# EAGLE schematic oresat-c3-v1 (EAGLE 9.5.1)

## Sheet 1 of 5: Connectors
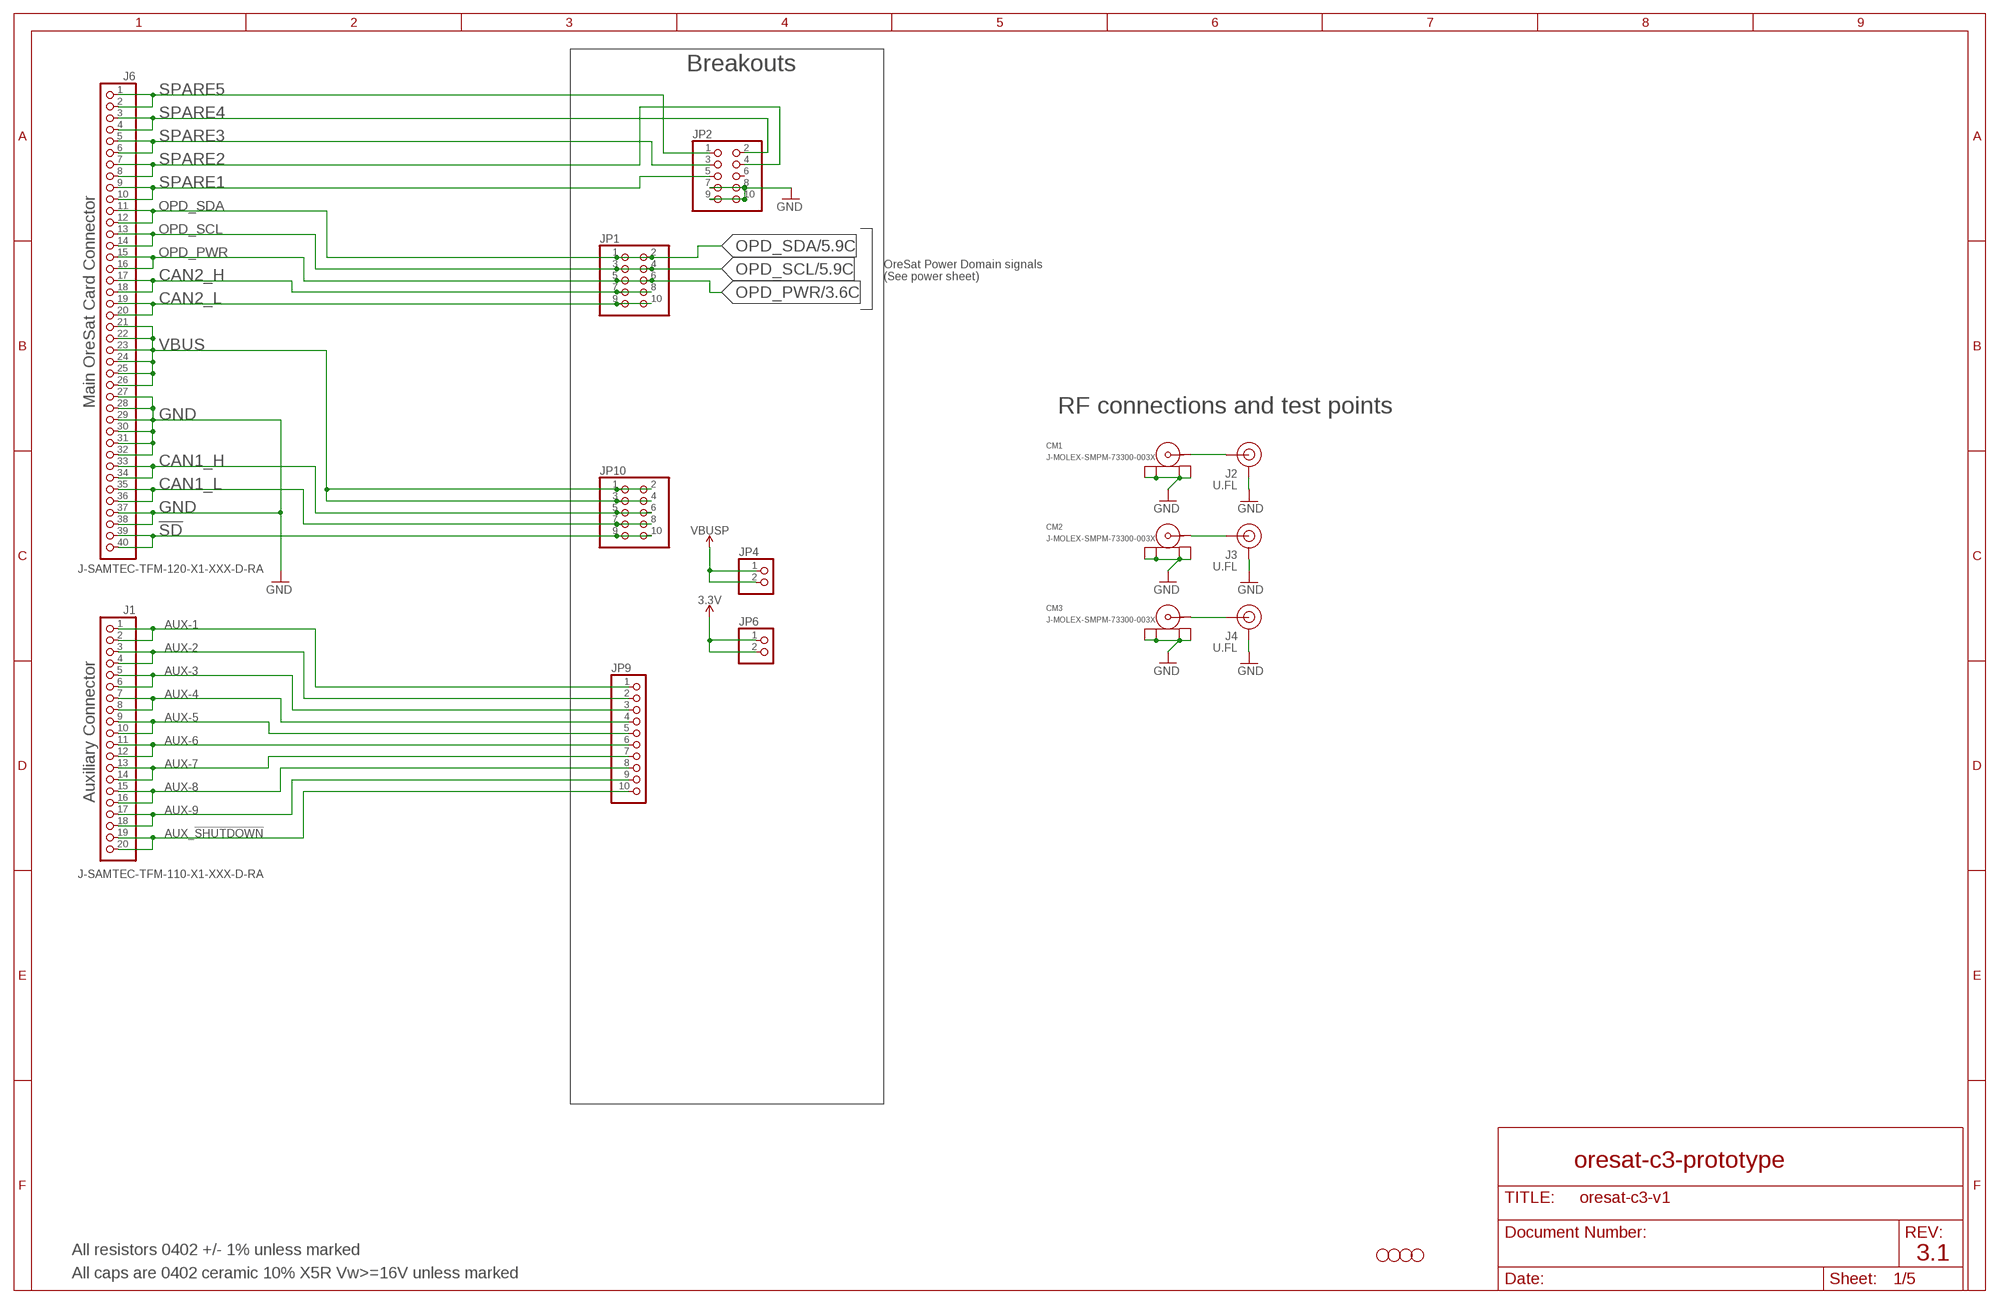
[diagram p0: schematic, sheet 1]

### Parts
CM1  J-MOLEX-SMPM-73300-003X  [J-MOLEX-SMPM-073300-003X]
CM2  J-MOLEX-SMPM-73300-003X  [J-MOLEX-SMPM-073300-003X]
CM3  J-MOLEX-SMPM-73300-003X  [J-MOLEX-SMPM-073300-003X]
H1  STAND-OFFTIGHT  [STAND-OFF-TIGHT]
H2  STAND-OFFTIGHT  [STAND-OFF-TIGHT]
H3  STAND-OFFTIGHT  [STAND-OFF-TIGHT]
H4  STAND-OFFTIGHT  [STAND-OFF-TIGHT]
J1  J-SAMTEC-TFM-110-X1-XXX-D-RA  [J-SAMTEC-TFM-110-X1-XXX-D-RA]
J2  U.FL  U.FL2PIN  [U.FL]
J3  U.FL  U.FL2PIN  [U.FL]
J4  U.FL  U.FL2PIN  [U.FL]
J6  J-SAMTEC-TFM-120-X1-XXX-D-RA  [J-SAMTEC-TFM-120-X1-XXX-D-RA]
JP1  PINHD-2X5  [2X05]
JP2  PINHD-2X5  [2X05]
JP4  PINHD-1X2  [1X02]
JP6  PINHD-1X2  [1X02]
JP9  PINHD-1X10  [1X10]
JP10  PINHD-2X5  [2X05]

### Nets
3.3V: JP6.1 JP6.2 ; also sheet 2,3,4,5
!SD: J6.39 J6.40 JP10.9 JP10.10 ; also sheet 5
AUX-1: J1.1 J1.2 JP9.1
AUX-2: J1.3 J1.4 JP9.2
AUX-3: J1.5 J1.6 JP9.3
AUX-4: J1.7 J1.8 JP9.4
AUX-5: J1.9 J1.10 JP9.5
AUX-6: J1.11 J1.12 JP9.6
AUX-7: J1.13 J1.14 JP9.7
AUX-8: J1.15 J1.16 JP9.8
AUX-9: J1.17 J1.18 JP9.9
AUX_!SHUTDOWN: J1.19 J1.20 JP9.10
CAN1_H: J6.33 J6.34 JP10.5 JP10.6 ; also sheet 5
CAN1_L: J6.35 J6.36 JP10.7 JP10.8 ; also sheet 5
CAN2_H: J6.17 J6.18 JP1.7 JP1.8 ; also sheet 5
CAN2_L: J6.19 J6.20 JP1.9 JP1.10 ; also sheet 5
GND: CM1.P$1(SHIELD3) CM1.P$2(SHIELD2) CM1.P$3(SHIELD1) CM1.P$4(SHIELD) CM2.P$1(SHIELD3) CM2.P$2(SHIELD2) CM2.P$3(SHIELD1) CM2.P$4(SHIELD) CM3.P$1(SHIELD3) CM3.P$2(SHIELD2) CM3.P$3(SHIELD1) CM3.P$4(SHIELD) J2.1(GND) J2.2(GND) J3.1(GND) J3.2(GND) J4.1(GND) J4.2(GND) J6.27 J6.28 J6.29 J6.30 J6.31 J6.32 J6.37 J6.38 JP2.7 JP2.8 JP2.9 JP2.10 ; also sheet 2,3,4,5
N$300: CM3.RF(CENTER) J4.FEED(SIGNAL)
OPD_PWR: J6.15 J6.16 JP1.5 JP1.6 ; also sheet 3,5
OPD_SCL: J6.13 J6.14 JP1.3 JP1.4 ; also sheet 5
OPD_SDA: J6.11 J6.12 JP1.1 JP1.2 ; also sheet 5
RF1: CM1.RF(CENTER) J2.FEED(SIGNAL)
RF2: CM2.RF(CENTER) J3.FEED(SIGNAL)
SPARE1: J6.9 J6.10 JP2.5
SPARE2: J6.7 J6.8 JP2.4
SPARE3: J6.5 J6.6 JP2.3
SPARE4: J6.3 J6.4 JP2.2
SPARE5: J6.1 J6.2 JP2.1
VBUS: J6.21 J6.22 J6.23 J6.24 J6.25 J6.26 JP10.1 JP10.2 JP10.3 JP10.4 ; also sheet 2
VBUSP: JP4.1 JP4.2 ; also sheet 2,5
Unconnected: JP2.6

### Notes on the sheet
- Breakouts
- OreSat Power Domain signals
  (See power sheet)
- Main OreSat Card Connector
- RF connections and test points
- Auxiliary Connector
- oresat-c3-prototype
- All resistors 0402 +/- 1% unless marked
- 3.1
- All caps are 0402 ceramic 10% X5R Vw>=16V unless marked

## Sheet 2 of 5: Power
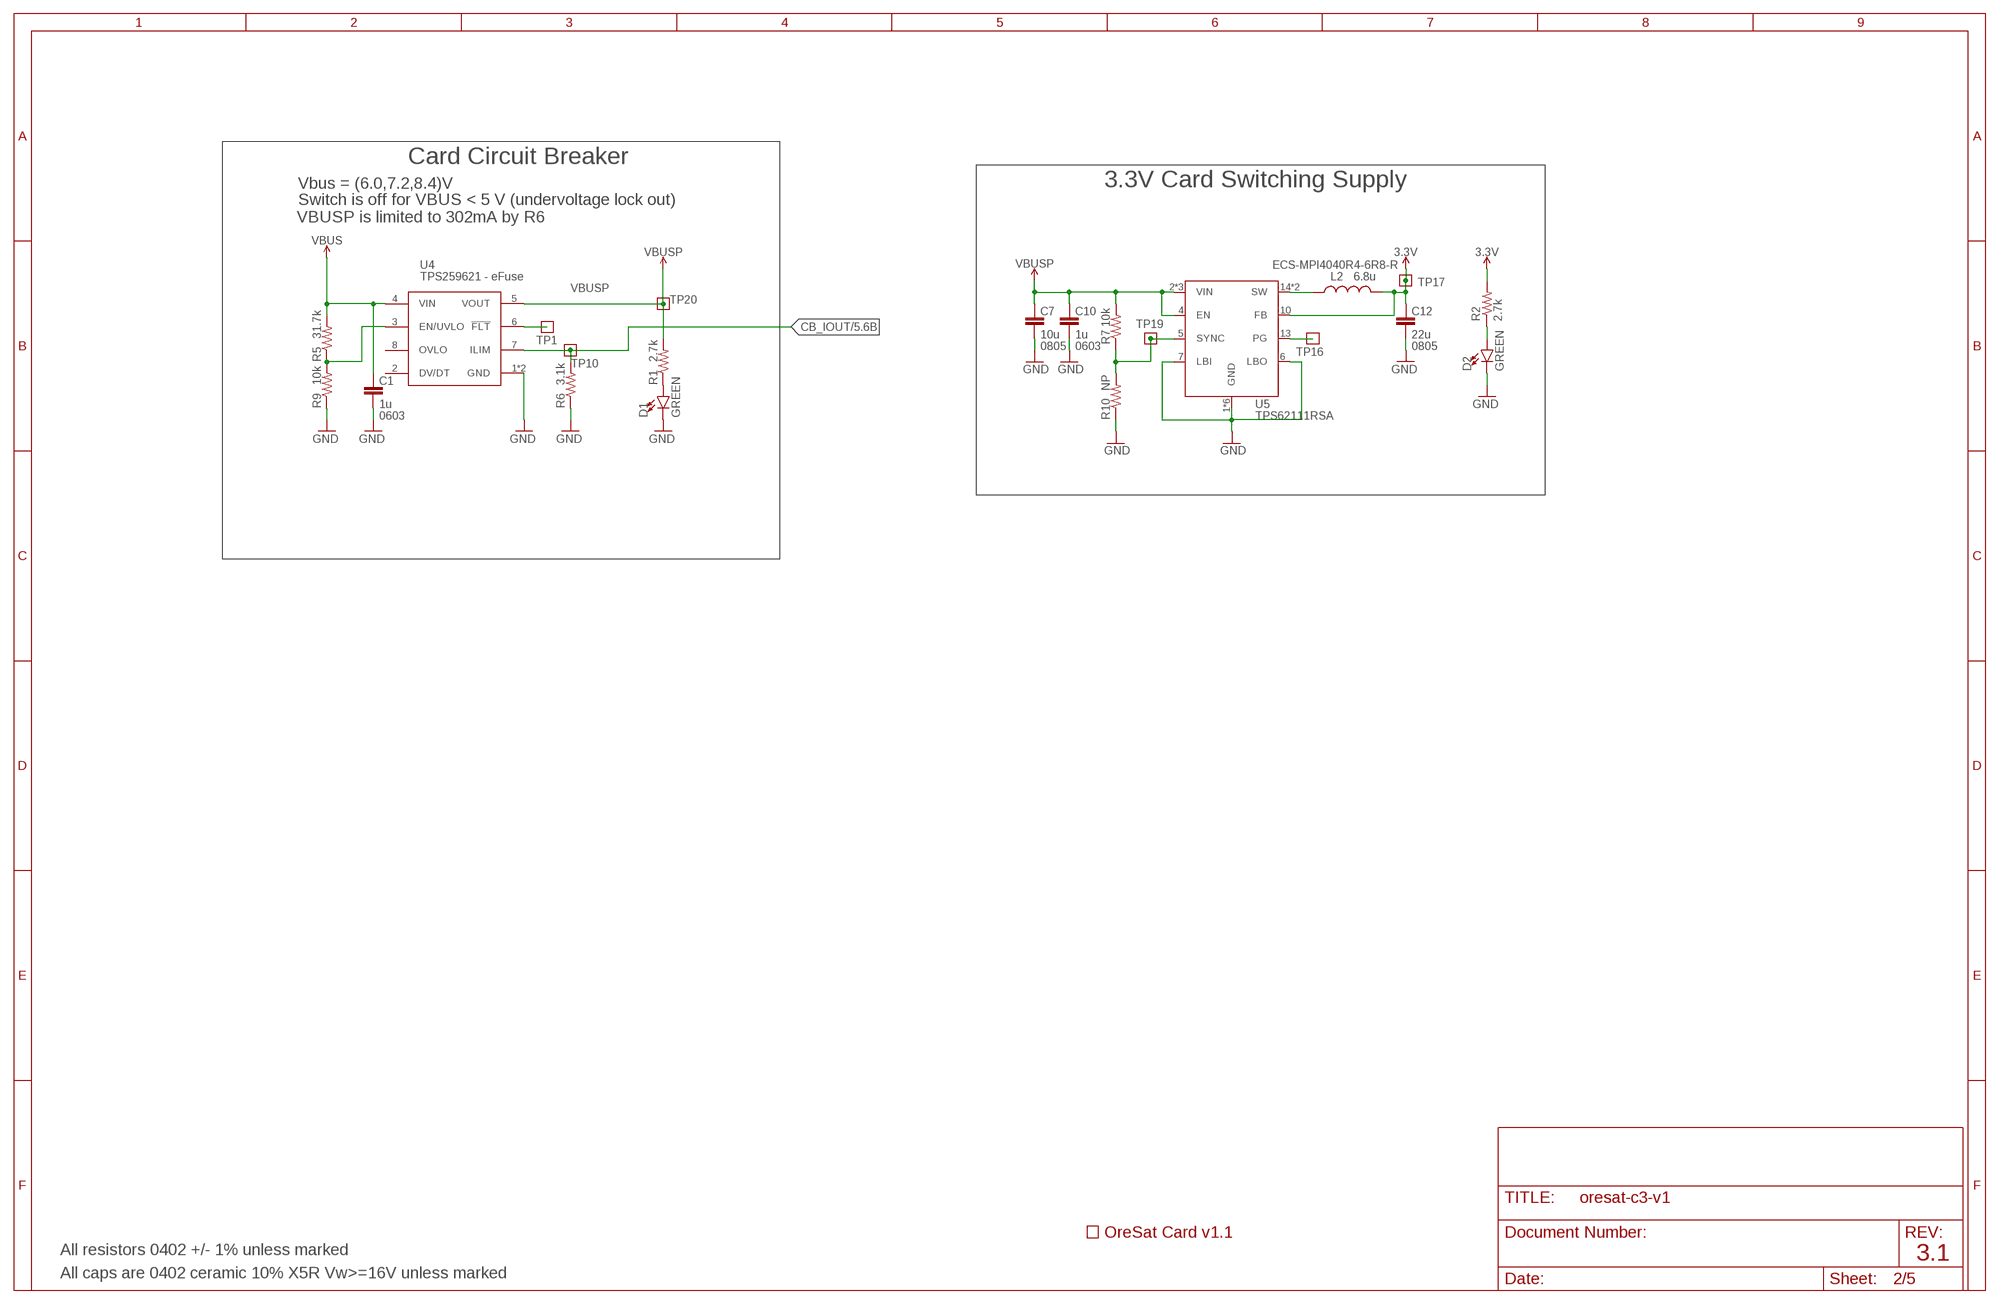
[diagram p1: schematic, sheet 2]

### Parts
C1  1u  C-EU0603-B-NOSILK  [.0603-B-NOSILK]
C7  10u  C-EU0805-B-NOSILK  [.0805-B-NOSILK]
C10  1u  C-EU0603-B-NOSILK  [.0603-B-NOSILK]
C12  22u  C-EU0805-B-NOSILK  [.0805-B-NOSILK]
D1  GREEN  LED-GREEN0603  [LED-0603]
D2  GREEN  LED-GREEN0603  [LED-0603]
L2  6.8u  L-ECS-MPI4040  [ECS-MPI4040]
R1  2.7k  R-US_0402-B-NOSILK  [.0402-B-NOSILK]
R2  2.7k  R-US_0402-B-NOSILK  [.0402-B-NOSILK]
R5  31.7k  R-US_0402-B-NOSILK  [.0402-B-NOSILK]
R6  3.1k  R-US_0402-B-NOSILK  [.0402-B-NOSILK]
R7  10k  R-US_0402-B-NOSILK  [.0402-B-NOSILK]
R9  10k  R-US_0402-B-NOSILK  [.0402-B-NOSILK]
R10  NP  R-US_0402-B-NOSILK  [.0402-B-NOSILK]
TP1  TEST-POINT  [2MM-TEST-POINT]
TP10  TEST-POINT  [2MM-TEST-POINT]
TP16  TEST-POINT  [2MM-TEST-POINT]
TP17  TEST-POINT  [2MM-TEST-POINT]
TP19  TEST-POINT  [2MM-TEST-POINT]
TP20  TEST-POINT  [2MM-TEST-POINT]
U4  TPS259621 - eFuse  TPS2596XX  [SO-POWERPAD-8]
U5  TPS62111RSA  TPS6211X  [S-PVQFN-16]
U$1  ORESAT-CARD-V1.1-3XRF  [ORESAT-CARD-V1.1-3XRF]

### Nets
3.3V: C12.1 L2.2 R2.2 TP17.1 U5.10(FB) ; also sheet 1,3,4,5
!CB_FLT: TP1.1 U4.6(!FLT)
CB_IOUT: R6.2 TP10.1 U4.7(ILIM) ; also sheet 5
EN/UVLO: R5.1 R9.2 U4.3(EN/UVLO)
GND: C1.2 C7.2 C10.2 C12.2 D1.C D2.C R6.1 R9.1 R10.1 U4.1(GND) U4.THERMAL(GND) U5.1(GND) U5.6(LBO) U5.7(LBI) U5.9(GND) U5.11(GND) U5.12(GND) U5.16(GND) U5.PAD(GND) ; also sheet 1,3,4,5
N$270: D1.A R1.1
N$271: D2.A R2.1
TPS62111-PG: TP16.1 U5.13(PG)
TPS62111-SYNC: R7.1 R10.2 TP19.1 U5.5(SYNC)
TPS62111_SW: L2.1 U5.14(SW) U5.15(SW)
VBUS: C1.1 R5.2 U4.4(VIN) ; also sheet 1
VBUSP: C7.1 C10.1 R1.2 R7.2 TP20.1 U4.5(VOUT) U5.2(VIN) U5.3(VIN) U5.4(EN) U5.8(VIN) ; also sheet 1,5
Unconnected: U4.2(DV/DT) U4.8(OVLO)

### Notes on the sheet
- Card Circuit Breaker
- Vbus = (6.0,7.2,8.4)V | 3.3V Card Switching Supply
- Switch is off for VBUS < 5 V (undervoltage lock out)
- VBUSP is limited to 302mA by R6
- ECS-MPI4040R4-6R8-R
- 0805 | 0603 | 0805
- 0603
- All resistors 0402 +/- 1% unless marked
- 3.1
- All caps are 0402 ceramic 10% X5R Vw>=16V unless marked

## Sheet 3 of 5: OPD
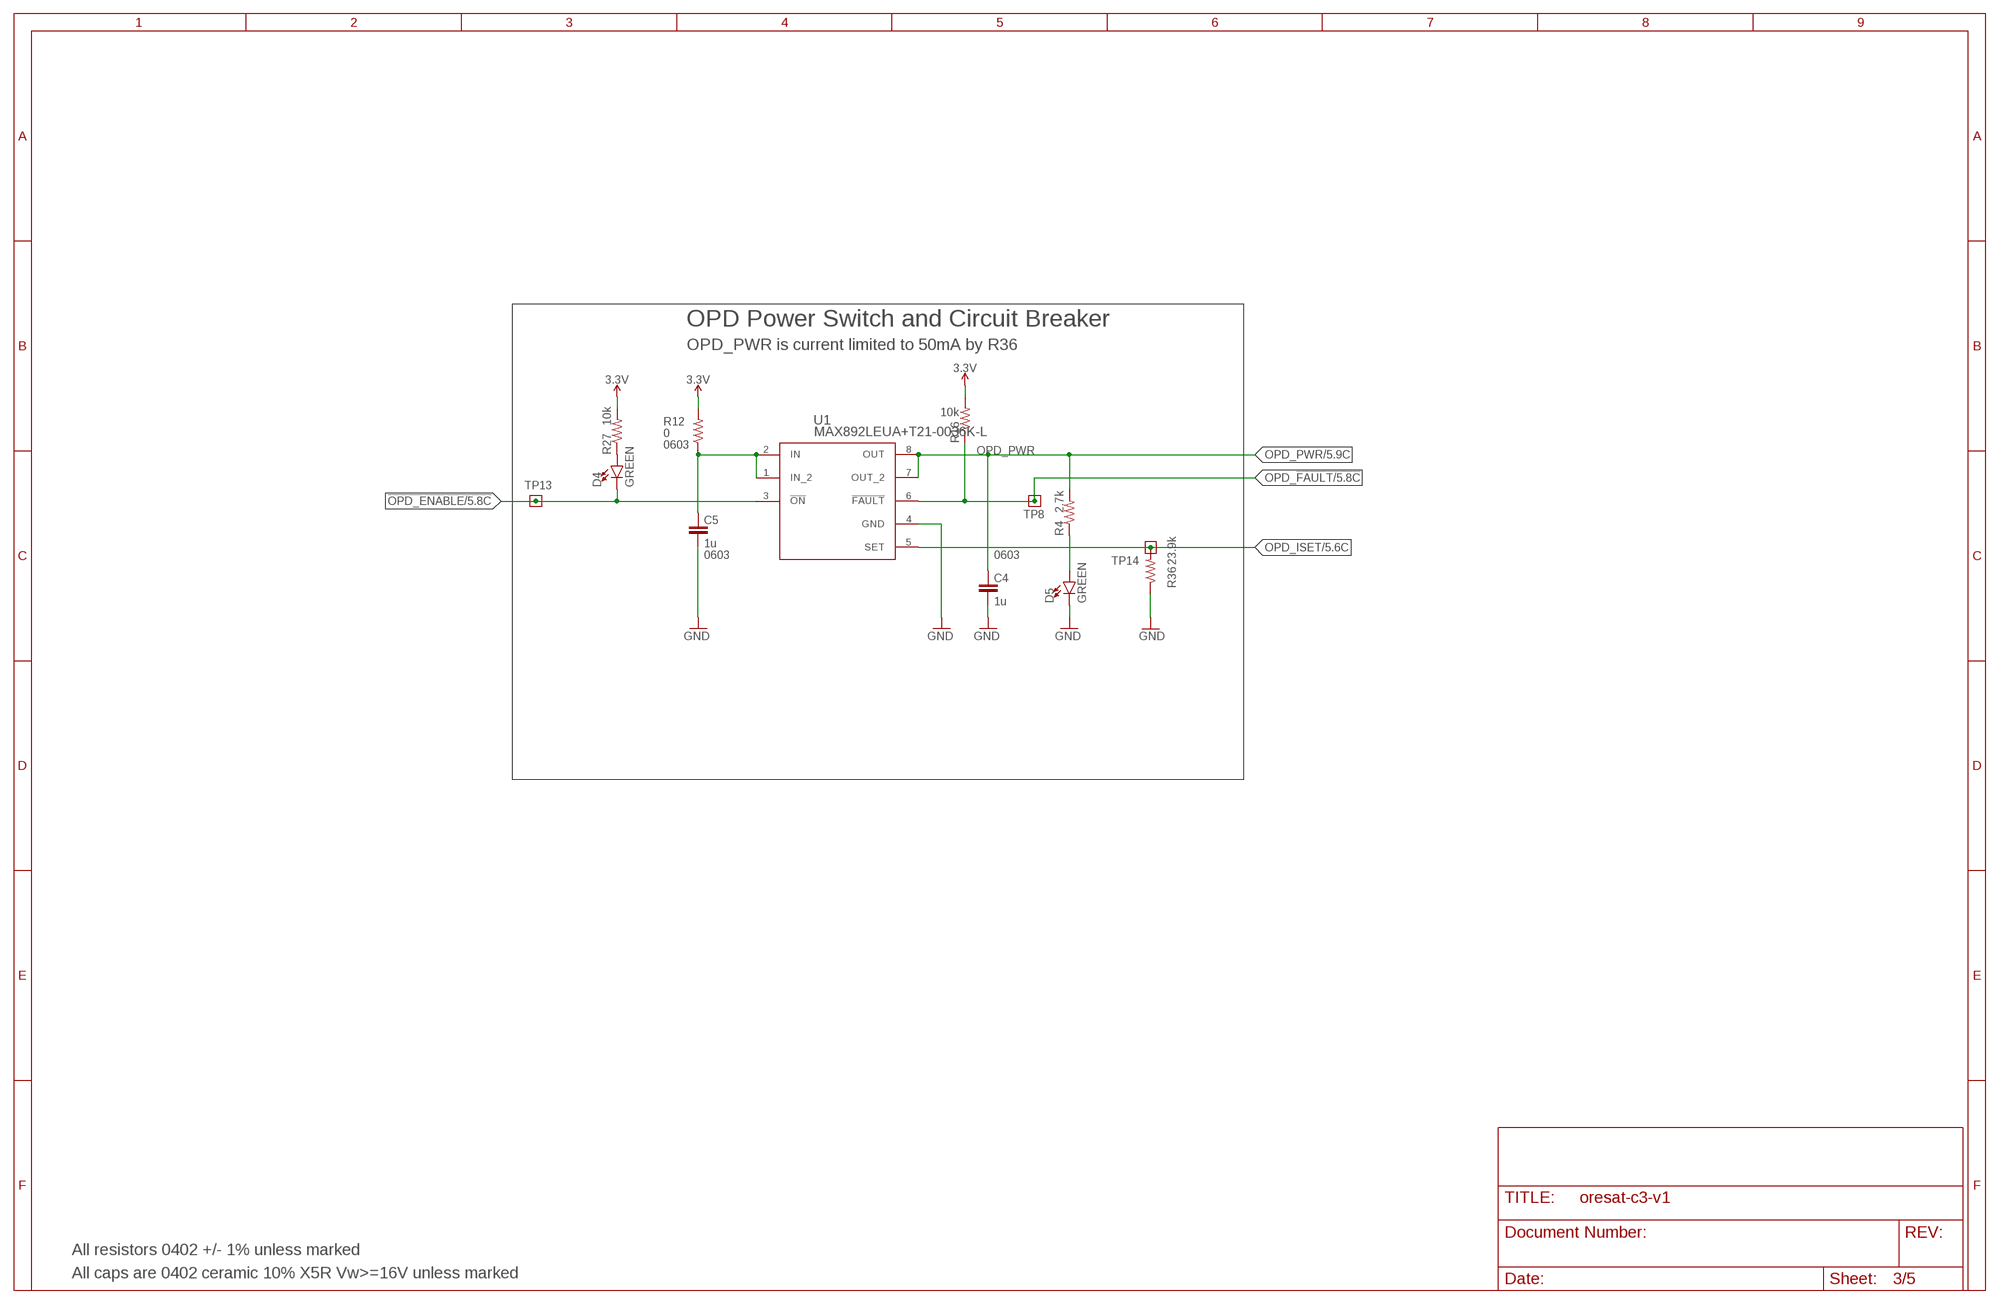
[diagram p2: schematic, sheet 3]

### Parts
C4  1u  C-EU0603-B-NOSILK  [.0603-B-NOSILK]
C5  1u  C-EU0603-B-NOSILK  [.0603-B-NOSILK]
D4  GREEN  LED-GREEN0603  [LED-0603]
D5  GREEN  LED-GREEN0603  [LED-0603]
R4  2.7k  R-US_0402-B-NOSILK  [.0402-B-NOSILK]
R12  0  R-US_0603-B-NOSILK  [.0603-B-NOSILK]
R16  10k  R-US_0402-B-NOSILK  [.0402-B-NOSILK]
R27  10k  R-US_0402-B-NOSILK  [.0402-B-NOSILK]
R36  23.9k  R-US_0402-B-NOSILK  [.0402-B-NOSILK]
TP8  TEST-POINT  [2MM-TEST-POINT]
TP13  TEST-POINT  [2MM-TEST-POINT]
TP14  TEST-POINT  [2MM-TEST-POINT]
U1  MAX892LEUA+T21-0036K-L  [21-0036K-L]

### Nets
3.3V: R12.2 R16.2 R27.2 ; also sheet 1,2,4,5
!OPD_ENABLE: D4.C TP13.1 U1.3(!ON) ; also sheet 5
GND: C4.2 C5.2 D5.C R36.1 U1.4(GND) ; also sheet 1,2,4,5
N$5: D4.A R27.1
N$400: D5.A R4.1
OPD-3.3V: C5.1 R12.1 U1.1(IN_2) U1.2(IN)
OPD_!FAULT: R16.1 TP8.1 U1.6(!FAULT) ; also sheet 5
OPD_ISET: R36.2 TP14.1 U1.5(SET) ; also sheet 5
OPD_PWR: C4.1 R4.2 U1.7(OUT_2) U1.8(OUT) ; also sheet 1,5

### Notes on the sheet
- OPD Power Switch and Circuit Breaker
- OPD_PWR is current limited to 50mA by R36
- 0603
- 0603 | 0603
- All resistors 0402 +/- 1% unless marked
- All caps are 0402 ceramic 10% X5R Vw>=16V unless marked

## Sheet 4 of 5: Radio
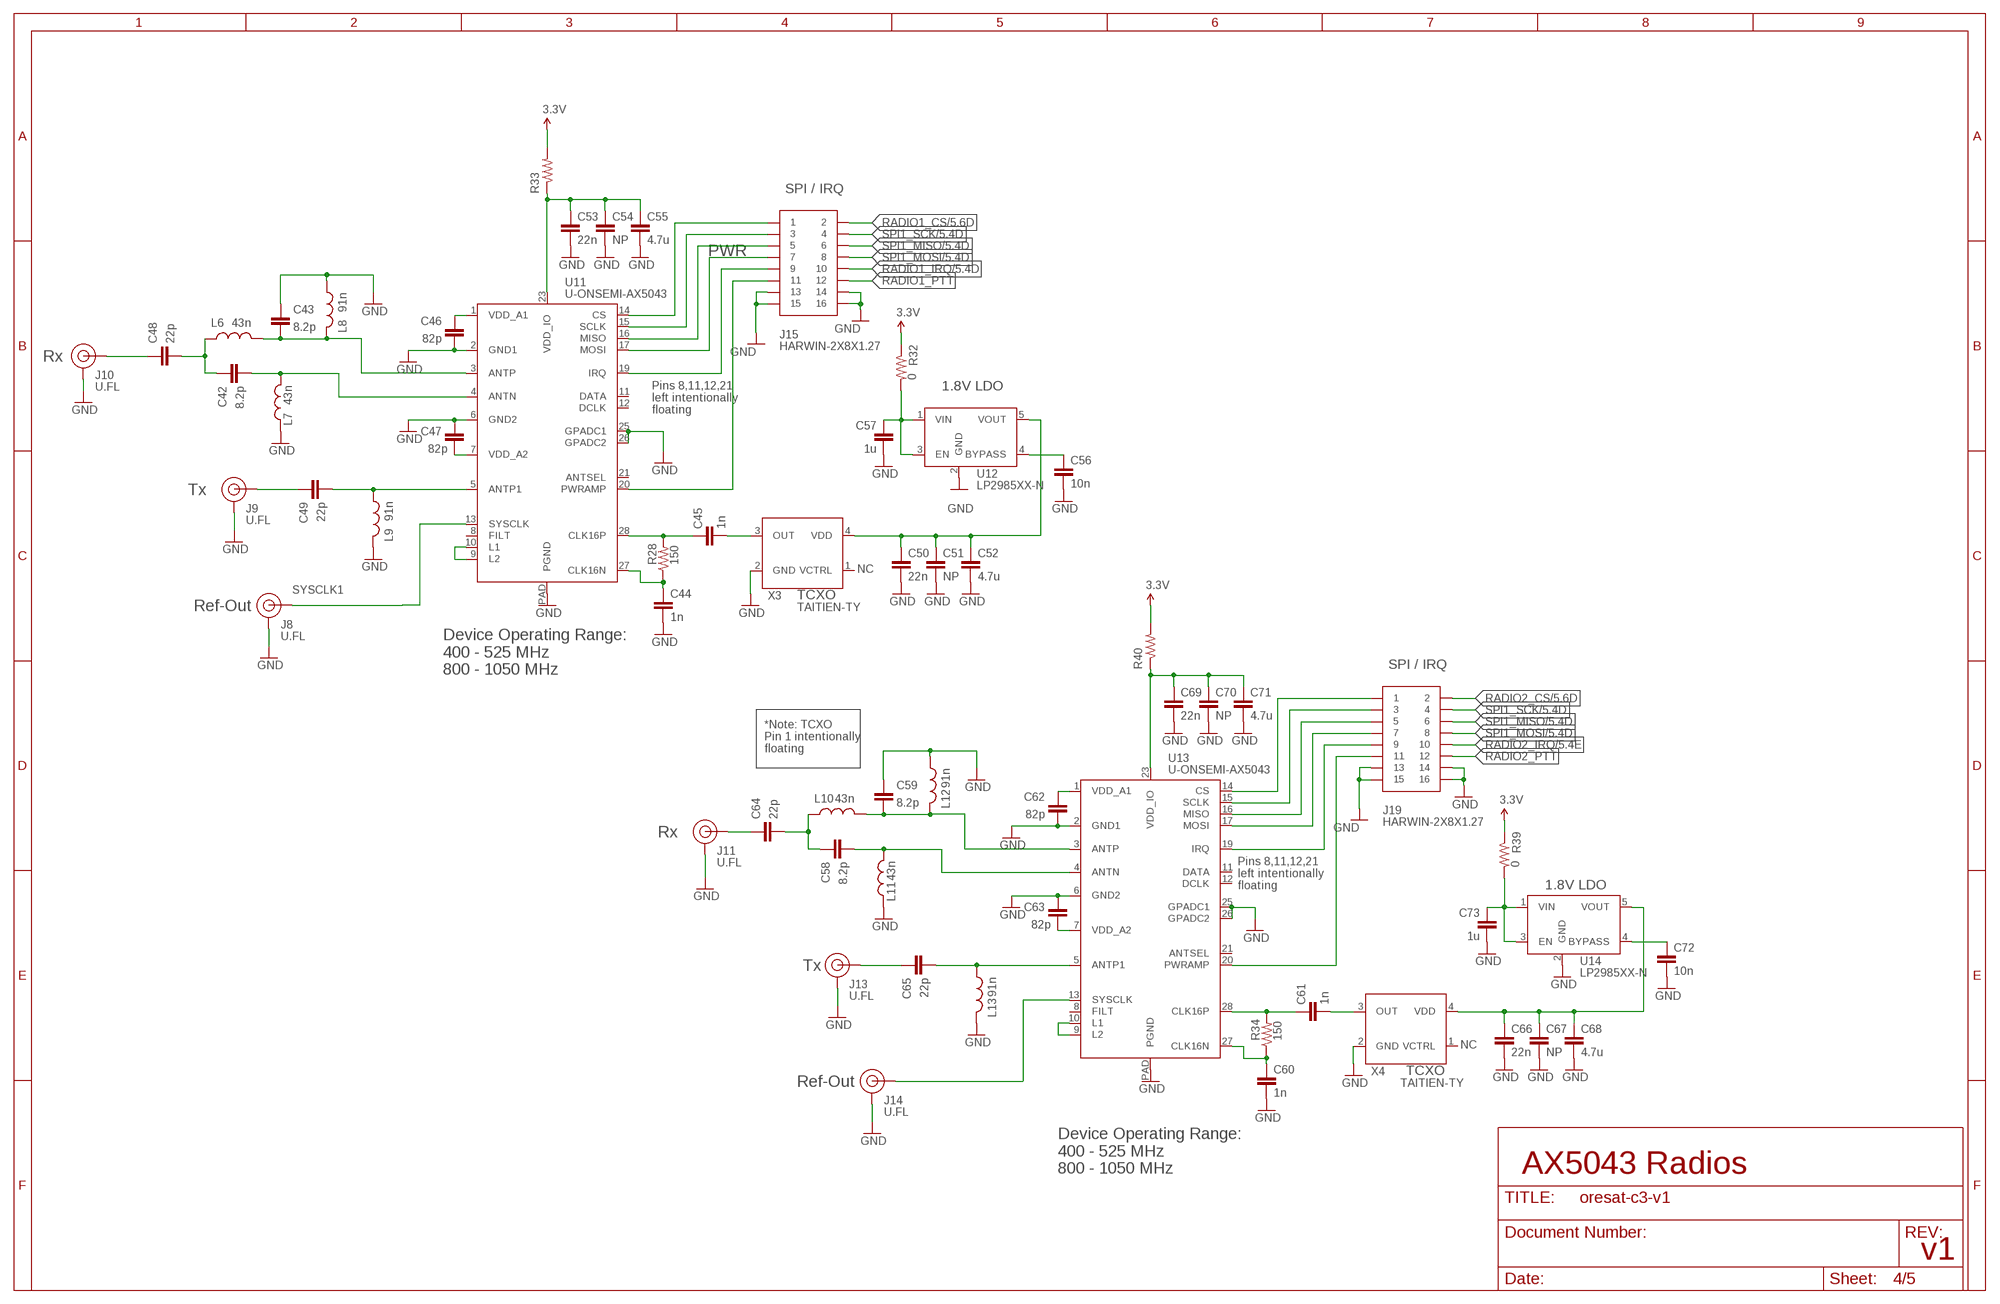
[diagram p3: schematic, sheet 4]

### Parts
C42  8.2p  C-EU0402-C-NOSILK  [.0402-C-NOSILK]
C43  8.2p  C-EU0402-C-NOSILK  [.0402-C-NOSILK]
C44  1n  C-EU0402-C-NOSILK  [.0402-C-NOSILK]
C45  1n  C-EU0402-C-NOSILK  [.0402-C-NOSILK]
C46  82p  C-EU0402-C-NOSILK  [.0402-C-NOSILK]
C47  82p  C-EU0402-C-NOSILK  [.0402-C-NOSILK]
C48  22p  C-EU0402-C-NOSILK  [.0402-C-NOSILK]
C49  22p  C-EU0402-C-NOSILK  [.0402-C-NOSILK]
C50  22n  C-EU0603-C-NOSILK  [.0603-C-NOSILK]
C51  NP  C-EU0603-C-NOSILK  [.0603-C-NOSILK]
C52  4.7u  C-EU0603-C-NOSILK  [.0603-C-NOSILK]
C53  22n  C-EU0603-C-NOSILK  [.0603-C-NOSILK]
C54  NP  C-EU0603-C-NOSILK  [.0603-C-NOSILK]
C55  4.7u  C-EU0603-C-NOSILK  [.0603-C-NOSILK]
C56  10n  C-EU0603-C-NOSILK  [.0603-C-NOSILK]
C57  1u  C-EU0603-C-NOSILK  [.0603-C-NOSILK]
C58  8.2p  C-EU0402-C-NOSILK  [.0402-C-NOSILK]
C59  8.2p  C-EU0402-C-NOSILK  [.0402-C-NOSILK]
C60  1n  C-EU0402-C-NOSILK  [.0402-C-NOSILK]
C61  1n  C-EU0402-C-NOSILK  [.0402-C-NOSILK]
C62  82p  C-EU0402-C-NOSILK  [.0402-C-NOSILK]
C63  82p  C-EU0402-C-NOSILK  [.0402-C-NOSILK]
C64  22p  C-EU0402-C-NOSILK  [.0402-C-NOSILK]
C65  22p  C-EU0402-C-NOSILK  [.0402-C-NOSILK]
C66  22n  C-EU0603-C-NOSILK  [.0603-C-NOSILK]
C67  NP  C-EU0603-C-NOSILK  [.0603-C-NOSILK]
C68  4.7u  C-EU0603-C-NOSILK  [.0603-C-NOSILK]
C69  22n  C-EU0603-C-NOSILK  [.0603-C-NOSILK]
C70  NP  C-EU0603-C-NOSILK  [.0603-C-NOSILK]
C71  4.7u  C-EU0603-C-NOSILK  [.0603-C-NOSILK]
C72  10n  C-EU0603-C-NOSILK  [.0603-C-NOSILK]
C73  1u  C-EU0603-C-NOSILK  [.0603-C-NOSILK]
J8  U.FL  U.FL2PIN  [U.FL]
J9  U.FL  U.FL2PIN  [U.FL]
J10  U.FL  U.FL2PIN  [U.FL]
J11  U.FL  U.FL2PIN  [U.FL]
J13  U.FL  U.FL2PIN  [U.FL]
J14  U.FL  U.FL2PIN  [U.FL]
J15  HARWIN-2X8X1.27  [2X8X1.27]
J19  HARWIN-2X8X1.27  [2X8X1.27]
L6  43n  L-US0402-C-NOSILK  [.0402-C-NOSILK]
L7  43n  L-US0402-C-NOSILK  [.0402-C-NOSILK]
L8  91n  L-US0603-C-NOSILK  [.0603-C-NOSILK]
L9  91n  L-US0603-C-NOSILK  [.0603-C-NOSILK]
L10  43n  L-US0402-C-NOSILK  [.0402-C-NOSILK]
L11  43n  L-US0402-C-NOSILK  [.0402-C-NOSILK]
L12  91n  L-US0603-C-NOSILK  [.0603-C-NOSILK]
L13  91n  L-US0603-C-NOSILK  [.0603-C-NOSILK]
R28  150  R-US_0402-C-NOSILK  [.0402-C-NOSILK]
R32  0  R-US_0603-C-NOSILK  [.0603-C-NOSILK]
R33  0  R-US_0603-C-NOSILK  [.0603-C-NOSILK]
R34  150  R-US_0402-C-NOSILK  [.0402-C-NOSILK]
R39  0  R-US_0603-C-NOSILK  [.0603-C-NOSILK]
R40  0  R-US_0603-C-NOSILK  [.0603-C-NOSILK]
U11  U-ONSEMI-AX5043  [QFN28-5X5-WITH-CENTER-PAD]
U12  LP2985XX-N  [SOT-23]
U13  U-ONSEMI-AX5043  [QFN28-5X5-WITH-CENTER-PAD]
U14  LP2985XX-N  [SOT-23]
X3  TAITIEN-TY  [2.5X2.0]
X4  TAITIEN-TY  [2.5X2.0]

### Nets
1V1: C50.1 C51.1 C52.1 U12.5(VOUT) X3.4(VDD)
1V2: C66.1 C67.1 C68.1 U14.5(VOUT) X4.4(VDD)
3.3V: R32.1 R33.2 R39.1 R40.2 ; also sheet 1,2,3,5
ANTN1: C42.2 L7.2 U11.4(ANTN)
ANTN2: C58.2 L11.2 U13.4(ANTN)
ANTP2 [RF1]: C43.2 L6.2 L8.1 U11.3(ANTP)
ANTP3 [RF1]: C49.2 L9.2 U11.5(ANTP1)
ANTP4 [RF1]: C59.2 L10.2 L12.1 U13.3(ANTP)
ANTP5 [RF1]: C65.2 L13.2 U13.5(ANTP1)
CLKN1: C44.1 R28.1 U11.27(CLK16N)
CLKN2: C60.1 R34.1 U13.27(CLK16N)
CLKP1: C45.1 R28.2 U11.28(CLK16P)
CLKP2: C61.1 R34.2 U13.28(CLK16P)
CS1: J15.1 U11.14(CS)
CS2: J19.1 U13.14(CS)
GND: C43.1 C44.2 C46.2 C47.1 C50.2 C51.2 C52.2 C53.2 C54.2 C55.2 C56.2 C57.2 C59.1 C60.2 C62.2 C63.1 C66.2 C67.2 C68.2 C69.2 C70.2 C71.2 C72.2 C73.2 J8.1(GND) J8.2(GND) J9.1(GND) J9.2(GND) J10.1(GND) J10.2(GND) J11.1(GND) J11.2(GND) J13.1(GND) J13.2(GND) J14.1(GND) J14.2(GND) J15.13 J15.14 J15.15 J15.16 J19.13 J19.14 J19.15 J19.16 L7.1 L8.2 L9.1 L11.1 L12.2 L13.1 U11.2(GND1) U11.6(GND2) U11.25(GPADC1) U11.26(GPADC2) U11.PAD(PGND) U12.2(GND) U13.2(GND1) U13.6(GND2) U13.25(GPADC1) U13.26(GPADC2) U13.PAD(PGND) U14.2(GND) X3.2(GND) X4.2(GND) ; also sheet 1,2,3,5
IRQ1: J15.9 U11.19(IRQ)
IRQ2: J19.9 U13.19(IRQ)
MISO1: J15.5 U11.16(MISO)
MISO2: J19.5 U13.16(MISO)
MOSI1: J15.7 U11.17(MOSI)
MOSI2: J19.7 U13.17(MOSI)
N$2: C64.1 J11.FEED(SIGNAL)
N$7: U11.9(L2) U11.10(L1)
N$8: C46.1 U11.1(VDD_A1)
N$9: C47.2 U11.7(VDD_A2)
N$10: C56.1 U12.4(BYPASS)
N$11 [RF2]: C42.1 C48.2 L6.1
N$12 [RF2]: C45.2 X3.3(OUT)
N$13: U13.9(L2) U13.10(L1)
N$14: C62.1 U13.1(VDD_A1)
N$15: C63.2 U13.7(VDD_A2)
N$16: C72.1 U14.4(BYPASS)
N$17 [RF2]: C58.1 C64.2 L10.1
N$18 [RF2]: C61.2 X4.3(OUT)
PWRAMP1: J15.11 U11.20(PWRAMP)
PWRAMP2: J19.11 U13.20(PWRAMP)
RADIO1_CS: J15.2 ; also sheet 5
RADIO1_IRQ: J15.10 ; also sheet 5
RADIO1_PTT: J15.12
RADIO2_CS: J19.2 ; also sheet 5
RADIO2_IRQ: J19.10 ; also sheet 5
RADIO2_PTT: J19.12
RX1 [RF1]: C48.1 J10.FEED(SIGNAL)
SCLK1: J15.3 U11.15(SCLK)
SCLK2: J19.3 U13.15(SCLK)
SPI1_MISO: J15.6 J19.6 ; also sheet 5
SPI1_MOSI: J15.8 J19.8 ; also sheet 5
SPI1_SCK: J15.4 J19.4 ; also sheet 5
SYSCLK1 [RF1]: J8.FEED(SIGNAL) U11.13(SYSCLK)
SYSCLK2 [RF1]: J14.FEED(SIGNAL) U13.13(SYSCLK)
TX1 [RF1]: C49.1 J9.FEED(SIGNAL)
TX2 [RF1]: C65.1 J13.FEED(SIGNAL)
VDD_IO-1: C53.1 C54.1 C55.1 R33.1 U11.23(VDD_IO)
VDD_IO-2: C69.1 C70.1 C71.1 R40.1 U13.23(VDD_IO)
VIN-1V8-1: C57.1 R32.2 U12.1(VIN) U12.3(EN)
VIN-1V8-2: C73.1 R39.2 U14.1(VIN) U14.3(EN)
Unconnected: U11.8(FILT) U11.11(DATA) U11.12(DCLK) U11.21(ANTSEL) U13.8(FILT) U13.11(DATA) U13.12(DCLK) U13.21(ANTSEL) X3.1(VCTRL) X4.1(VCTRL)

### Notes on the sheet
- SPI / IRQ
- PWR
- Rx
- 1.8V LDO
- Pins 8,11,12,21
  left intentionally 
  floating
- Tx
- NC
- TCXO
- Ref-Out
- SPI / IRQ
- Device Operating Range:
  400 - 525 MHz
  800 - 1050 MHz
- *Note: TCXO
  Pin 1 intentionally 
  floating
- Rx
- Pins 8,11,12,21
  left intentionally 
  floating
- 1.8V LDO
- Tx
- NC
- TCXO
- Ref-Out
- Device Operating Range:
  400 - 525 MHz
  800 - 1050 MHz
- AX5043 Radios
- v1

## Sheet 5 of 5: Microcontroller
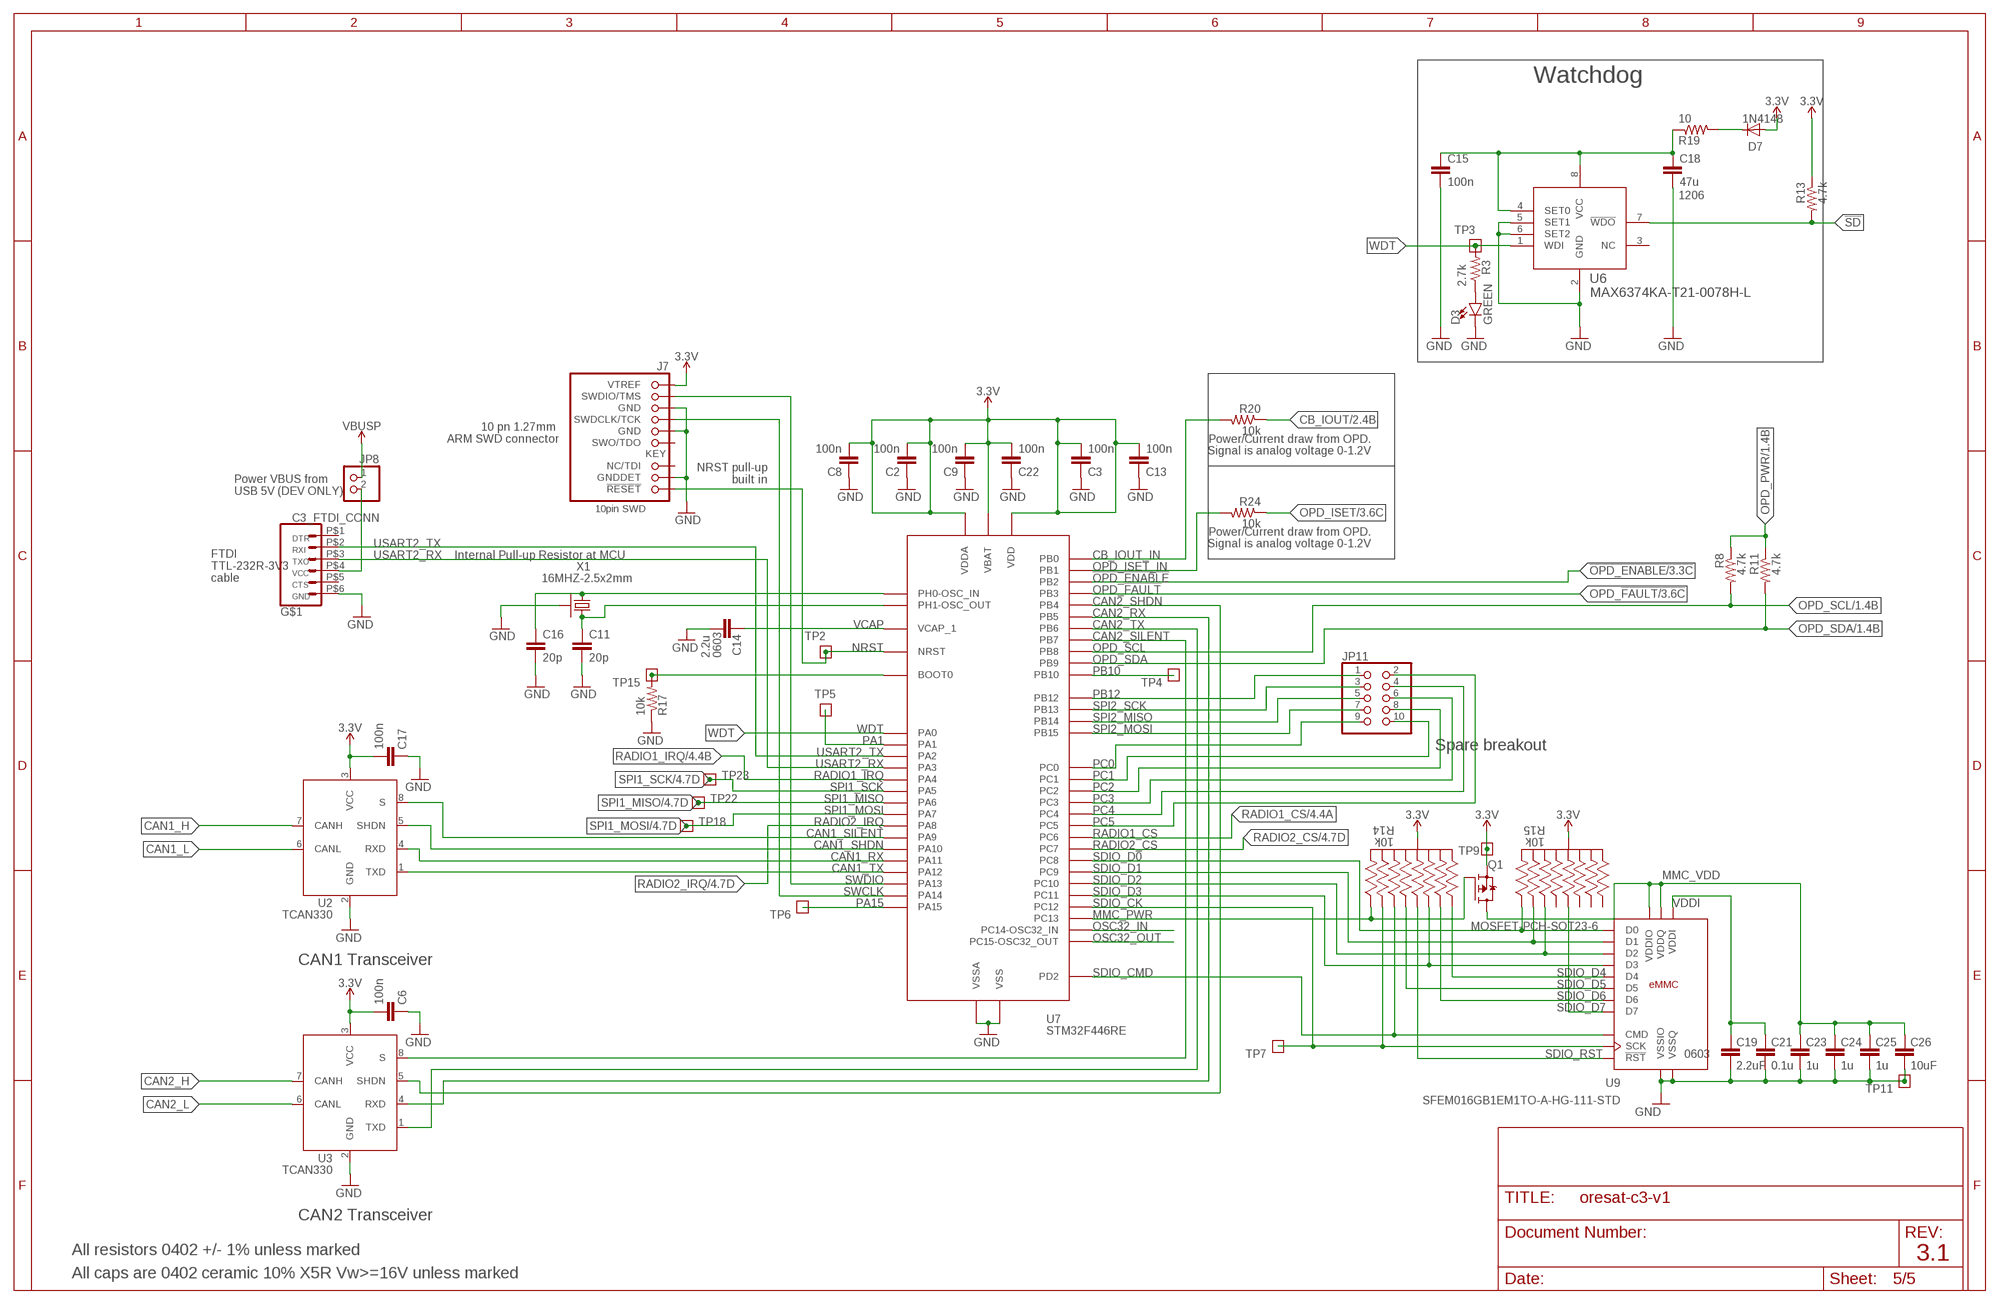
[diagram p4: schematic, sheet 5]

### Parts
C2  100n  C-EU0402-B-NOSILK  [.0402-B-NOSILK]
C3  100n  C-EU0402-B-NOSILK  [.0402-B-NOSILK]
C6  100n  C-EU0402-B-NOSILK  [.0402-B-NOSILK]
C8  100n  C-EU0402-B-NOSILK  [.0402-B-NOSILK]
C9  100n  C-EU0402-B-NOSILK  [.0402-B-NOSILK]
C11  20p  C-EU0402-B-NOSILK  [.0402-B-NOSILK]
C13  100n  C-EU0402-B-NOSILK  [.0402-B-NOSILK]
C14  2.2u  C-EU0603-B-NOSILK  [.0603-B-NOSILK]
C15  100n  C-EU0402-B-NOSILK  [.0402-B-NOSILK]
C16  20p  C-EU0402-B-NOSILK  [.0402-B-NOSILK]
C17  100n  C-EU0402-B-NOSILK  [.0402-B-NOSILK]
C18  47u  C-EU1206-B  [1206-B]
C19  2.2uF  C-EU0603-B-NOSILK  [.0603-B-NOSILK]
C21  0.1u  C-EU0603-B-NOSILK  [.0603-B-NOSILK]
C22  100n  C-EU0402-B-NOSILK  [.0402-B-NOSILK]
C23  1u  C-EU0603-B-NOSILK  [.0603-B-NOSILK]
C24  1u  C-EU0603-B-NOSILK  [.0603-B-NOSILK]
C25  1u  C-EU0603-B-NOSILK  [.0603-B-NOSILK]
C26  10uF  C-EU0603-B-NOSILK  [.0603-B-NOSILK]
D3  GREEN  LED-GREEN0603  [LED-0603]
D7  1N4148  DIODESOD  [SOD-323]
J7  FTSH-105-XX-X-DV-K  [CON10_2X5_DUK_FTSH]
JP8  PINHD-1X2  [1X02]
JP11  PINHD-2X5  [2X05]
Q1  MOSFET-PCH-SOT23-6  [SOT23-6]
R3  2.7k  R-US_0402-B-NOSILK  [.0402-B-NOSILK]
R8  4.7k  R-US_0402-B-NOSILK  [.0402-B-NOSILK]
R11  4.7k  R-US_0402-B-NOSILK  [.0402-B-NOSILK]
R13  4.7k  R-US_0402-B-NOSILK  [.0402-B-NOSILK]
R14  10k  EXB-A10P391JC_ARRAY_EXBA-M  [ARRAY_EXBA-M]
R15  10k  EXB-A10P391JC_ARRAY_EXBA-M  [ARRAY_EXBA-M]
R17  10k  R-US_0402-B-NOSILK  [.0402-B-NOSILK]
R19  10  R-US_0402-B-NOSILK  [.0402-B-NOSILK]
R20  10k  R-US_0402-B-NOSILK  [.0402-B-NOSILK]
R24  10k  R-US_0402-B-NOSILK  [.0402-B-NOSILK]
TP2  TEST-POINT  [2MM-TEST-POINT]
TP3  TEST-POINT  [2MM-TEST-POINT]
TP4  TEST-POINT  [2MM-TEST-POINT]
TP5  TEST-POINT  [2MM-TEST-POINT]
TP6  TEST-POINT  [2MM-TEST-POINT]
TP7  TEST-POINT  [2MM-TEST-POINT]
TP9  TEST-POINT  [2MM-TEST-POINT]
TP11  TEST-POINT  [2MM-TEST-POINT]
TP15  TEST-POINT  [2MM-TEST-POINT]
TP18  TEST-POINT  [2MM-TEST-POINT]
TP22  TEST-POINT  [2MM-TEST-POINT]
TP23  TEST-POINT  [2MM-TEST-POINT]
U2  TCAN330  [SOT23-8_TI-DCN]
U3  TCAN330  [SOT23-8_TI-DCN]
U6  MAX6374KA-T21-0078H-L  [21-0078H-L]
U7  STM32F446RE  [QFP-10X10-64]
U9  SFEM016GB1EM1TO-A-HG-111-STD  EMMC+RESET-BA  [BGA-153(11.5X13)(EMMC-BA)]
U$2  C3_FTDI_CONN  [6_PIN_SERIAL_TARGET_SIDE_W_SILK]
X1  16MHZ-2.5x2mm  CRYSTAL-WITH-GND  [CRYSTAL_2.5X2]

### Nets
3.3V: C2.2 C3.2 C6.2 C8.2 C9.2 C13.2 C17.2 C22.2 D7.2(A) J7.1(VTREF) Q1.4(S) R13.1 R14.5 R14.10 R15.5 R15.10 TP9.1 U2.3(VCC) U3.3(VCC) U7.1(VBAT) U7.13(VDDA) U7.19(VDD) U7.32(VDD) U7.48(VDD) U7.64(VDD) ; also sheet 1,2,3,4
!OPD_ENABLE: U7.28(PB2) ; also sheet 3
!SD: R13.2 U6.7(!WDO) ; also sheet 1
BOOT0: R17.2 TP15.1 U7.60(BOOT0)
CAN1_H: U2.7(CANH) ; also sheet 1
CAN1_L: U2.6(CANL) ; also sheet 1
CAN1_RX: U2.4(RXD) U7.44(PA11)
CAN1_SHDN: U2.5(SHDN) U7.43(PA10)
CAN1_SILENT: U2.8(S) U7.42(PA9)
CAN1_TX: U2.1(TXD) U7.45(PA12)
CAN2_H: U3.7(CANH) ; also sheet 1
CAN2_L: U3.6(CANL) ; also sheet 1
CAN2_RX: U3.4(RXD) U7.57(PB5)
CAN2_SHDN: U3.5(SHDN) U7.56(PB4)
CAN2_SILENT: U3.8(S) U7.59(PB7)
CAN2_TX: U3.1(TXD) U7.58(PB6)
CB_IOUT: R20.1 ; also sheet 2
CB_IOUT_IN: R20.2 U7.26(PB0)
CRYSTALIN: C16.1 U7.5(PH0-OSC_IN) X1.1
CRYSTALOUT: C11.1 U7.6(PH1-OSC_OUT) X1.3
GND: C2.1 C3.1 C6.1 C8.1 C9.1 C11.2 C13.1 C14.2 C15.2 C16.2 C17.1 C18.2 C19.2 C21.2 C22.1 C23.2 C24.2 C25.2 C26.2 D3.C J7.3(GND) J7.5(GND) J7.9(GNDDET) R17.1 TP11.1 U2.2(GND) U3.2(GND) U6.2(GND) U6.5(SET1) U6.6(SET2) U7.12(VSSA) U7.18(VSS) U7.31(VSS) U7.47(VSS) U7.63(VSS) U9.A6(VSSIO) U9.C4(VSSQ) U9.D4(VSSIO) U9.E7(VSSIO) U9.G5(VSSIO) U9.H10(VSSIO) U9.J5(VSSIO) U9.K8(VSSIO) U9.N1(VSSQ) U9.N2(VSSQ) U9.N5(VSSQ) U9.P4(VSSQ) U9.P6(VSSQ) U$2.P$6(GND) X1.2(SHIELD) X1.4(SHIELD) ; also sheet 1,2,3,4
MMC_PWR: Q1.3(G) R14.1 U7.2(PC13)
MMC_VDD: C23.1 C24.1 C25.1 C26.1 Q1.1(D) Q1.2(D) Q1.5(D) Q1.6(D) U9.C6(VDDQ) U9.E6(VDDIO) U9.F5(VDDIO) U9.J10(VDDIO) U9.K9(VDDIO) U9.M4(VDDQ) U9.N4(VDDQ) U9.P3(VDDQ) U9.P5(VDDQ)
N$1: D3.A R3.1
N$3: D7.1(C) R19.2
N$406: JP8.2 U$2.P$4(VCC)
NRST: J7.10(!RESET) TP2.1 U7.7(NRST)
OPD_!FAULT: U7.55(PB3) ; also sheet 3
OPD_ISET: R24.1 ; also sheet 3
OPD_ISET_IN: R24.2 U7.27(PB1)
OPD_PWR: R8.1 R11.1 ; also sheet 1,3
OPD_SCL: R8.2 U7.61(PB8) ; also sheet 1
OPD_SDA: R11.2 U7.62(PB9) ; also sheet 1
OSC32_IN: U7.3(PC14-OSC32_IN)
OSC32_OUT: U7.4(PC15-OSC32_OUT)
PA1: TP5.1 U7.15(PA1)
PA15: TP6.1 U7.50(PA15)
PB10: TP4.1 U7.29(PB10)
PB12: JP11.1 U7.33(PB12)
PC0: JP11.9 U7.8(PC0)
PC1: JP11.10 U7.9(PC1)
PC2: JP11.8 U7.10(PC2)
PC3: JP11.6 U7.11(PC3)
PC4: JP11.4 U7.24(PC4)
PC5: JP11.2 U7.25(PC5)
RADIO1_CS: U7.37(PC6) ; also sheet 4
RADIO1_IRQ: U7.20(PA4) ; also sheet 4
RADIO2_CS: U7.38(PC7) ; also sheet 4
RADIO2_IRQ: U7.41(PA8) ; also sheet 4
SDIO_CK: R14.9 TP7.1 U7.53(PC12) U9.M6(SCK)
SDIO_CMD: R14.2 U7.54(PD2) U9.M5(CMD)
SDIO_D0: R15.1 U7.39(PC8) U9.A3(D0)
SDIO_D1: R15.9 U7.40(PC9) U9.A4(D1)
SDIO_D2: R15.2 U7.51(PC10) U9.A5(D2)
SDIO_D3: R14.7 U7.52(PC11) U9.A1(D3) U9.B2(D3)
SDIO_D4: R14.6 U9.A2(D4) U9.B3(D4)
SDIO_D5: R14.8 U9.B4(D5) U9.C3(D5) U9.D3(D5)
SDIO_D6: R14.4 U9.B5(D6) U9.C5(D6)
SDIO_D7: R15.3 U9.B6(D7) U9.C7(D7)
SDIO_RST: R14.3 U9.K5(!RST!)
SPI1_MISO: TP22.1 U7.22(PA6) ; also sheet 4
SPI1_MOSI: TP18.1 U7.23(PA7) ; also sheet 4
SPI1_SCK: TP23.1 U7.21(PA5) ; also sheet 4
SPI2_MISO: JP11.5 U7.35(PB14)
SPI2_MOSI: JP11.7 U7.36(PB15)
SPI2_SCK: JP11.3 U7.34(PB13)
SWCLK: J7.4(SWDCLK/TCK) U7.49(PA14)
SWDIO: J7.2(SWDIO/TMS) U7.46(PA13)
USART2_RX: U7.17(PA3) U$2.P$3(TXO)
USART2_TX: U7.16(PA2) U$2.P$2(RXI)
VBUSP: JP8.1 ; also sheet 1,2
VCAP: C14.1 U7.30(VCAP_1)
VDDI: C19.1 C21.1 U9.C1(VDDI) U9.C2(VDDI)
WDT: R3.2 TP3.1 U6.1(WDI) U7.14(PA0)
WDT-PWR: C15.1 C18.1 R19.1 U6.4(SET0) U6.8(VCC)
Unconnected: J7.6(SWO/TDO) J7.8(NC/TDI) R15.4 R15.6 R15.7 R15.8 U6.3(NC) U$2.P$1(DTR) U$2.P$5(CTS)

### Notes on the sheet
- Watchdog
- 1206
- 10 pn 1.27mm 
  ARM SWD connector
- Power/Current draw from OPD.
- Signal is analog voltage 0-1.2V
- NRST pull-up
  built in
- Power VBUS from
  USB 5V (DEV ONLY)
- Power/Current draw from OPD.
- Signal is analog voltage 0-1.2V
- Internal Pull-up Resistor at MCU
- FTDI 
  TTL-232R-3V3
  cable
- 0603
- Spare breakout
- CAN1 Transceiver
- 0603
- CAN2 Transceiver
- All resistors 0402 +/- 1% unless marked
- 3.1
- All caps are 0402 ceramic 10% X5R Vw>=16V unless marked

## Library data of the parts
C1-C6 C8-C10 C13 C14 C17 C19 C21-C26 = oresat-rcl:C-EU: CAPACITOR, European symbol; DIS: Digi-Key; DPN: 1276-1001-1-ND; MFR: Samsung; MPN: CL05B104KO5NNNC
C7 C12 C42-C73 = oresat-rcl:C-EU: CAPACITOR, European symbol
C11 = rcl_custom:C-EU: CAPACITOR, European symbol; DIS: Digi-Key; DPN: 1276-6601-1-ND; MFR: Samsung; MPN: CL05C200JB51PNC
C15 C16 C18 = oresat-rcl:C-EU: CAPACITOR, European symbol; DIS: Digi-Key; DPN: 1276-6601-1-ND; MFR: Samsung; MPN: CL05C200JB51PNC
CM1-CM3 = J-Molex-SMPM-73300-003X:J-MOLEX-SMPM-73300-003X; MFR: Molex; MPN: 73300-0020
D1 D2 D4 D5 = SparkFun-LED:LED-GREEN: Green SMD LED Used in manufacturing of various products at SparkFun Packages: 0603 - SMD 0603 package [Product Link] <http://www.futureelectronics.com/en/technologies/semiconductors/optoelectronics/leds/Pages/9894312-LTST-C190GKT.aspx?CrossPart=HSMG-C190&IM=0> LilyPad 1206 - SMD1206 LilyPad package [Product Link] <http://www.futureelectronics.com/en/Technologies/Product.aspx?ProductID=IN150NGHARVATEKCORPORATION2049943&IM=0> 1206 - SMD1206 package [Product Link] <http://www.futureelectronics.com/en/technologies/semiconductors/optoelectronics/leds/Pages/8315665-LTST-C150KGKT.aspx?IM=0> 1206 Bottom Mount -SMD 1206 Bottom Mount [Product Link] <http://www.digikey.com/product-detail/en/lite-on-inc/LTST-C230KGKT/160-1456-1-ND/386854> SparkFun Products: Pro Mini 328 -5V <https://www.sparkfun.com/products/821> RedBoard <https://www.sparkfun.com/products/12757> MP3 Trigger <https://www.sparkfun.com/products/13720> Makey Makey <https://www.sparkfun.com/products/11076>
D3 = SparkFun-LED:LED-GREEN: Green SMD LED Used in manufacturing of various products at SparkFun Packages: 0603 - SMD 0603 package [Product Link] <http://www.futureelectronics.com/en/technologies/semiconductors/optoelectronics/leds/Pages/9894312-LTST-C190GKT.aspx?CrossPart=HSMG-C190&IM=0> LilyPad 1206 - SMD1206 LilyPad package [Product Link] <http://www.futureelectronics.com/en/Technologies/Product.aspx?ProductID=IN150NGHARVATEKCORPORATION2049943&IM=0> 1206 - SMD1206 package [Product Link] <http://www.futureelectronics.com/en/technologies/semiconductors/optoelectronics/leds/Pages/8315665-LTST-C150KGKT.aspx?IM=0> 1206 Bottom Mount -SMD 1206 Bottom Mount [Product Link] <http://www.digikey.com/product-detail/en/lite-on-inc/LTST-C230KGKT/160-1456-1-ND/386854> SparkFun Products: Pro Mini 328 -5V <https://www.sparkfun.com/products/821> RedBoard <https://www.sparkfun.com/products/12757> MP3 Trigger <https://www.sparkfun.com/products/13720> Makey Makey <https://www.sparkfun.com/products/11076>; PROD_ID: DIO-00821
D7 = SparkFun:DIODE: Diode These are standard reverse protection diodes and small signal diodes. SMA package can handle up to about 1A. SOD-323 can handle about 200mA. What the SOD-323 package when ordering, there are some mfgs out there that are 5-pin packages.
H1-H4 = SparkFun-Hardware:STAND-OFF: Stand Off Drill holes for mechanically mounting via screws, standoffs, etc. Note: Use the keepout ring to avoid running the screw head into surrounding components. Variant Overviews STAND-OFF - Mechanical footprint for a #4 phillips button head screw. STAND-OFF-TIGHT - Mechanical footprint for a #4 phillips button head screw, Example SparkFun Products Screw - Phillips Head (1/4", 4-40, 10 pack) <https://www.sparkfun.com/products/10453> (PRT-10453) Screw - Phillips Head (1/2", 4-40, 10 pack) <https://www.sparkfun.com/products/10452> (PRT-10452) Screw - Phillips Head (3/4", 4-40, 10 pack) <https://www.sparkfun.com/products/10451> (PRT-10451) Screw - Phillips Head (1", 4-40, 10 pack) <https://www.sparkfun.com/products/10450> (PRT-10450)
J1 = J-Samtec-TFM-110-X1-XXX-D-RA:J-SAMTEC-TFM-110-X1-XXX-D-RA; MFR: Samtec; MPN: TFM-110-01-L-D-RA
J2-J4 J8-J11 J13 J14 = SparkFun-Connectors:U.FL2PIN: SMD Antenna Connector - U.FL 2mm height, 3.0mm x 3.0mm receptacle size. SparkFun Products: SparkFun WiFi Shield - ESP8266 <https://www.sparkfun.com/products/13287> SparkFun ESP8266 Thing <https://www.sparkfun.com/products/13231> SparkFun MiniGen - Pro Mini Signal Generator Shield <https://www.sparkfun.com/products/11420>; PROD_ID: CONN-09193; SF_ID: WRL-09144
J6 = J-Samtec-TFM-120-X1-XXX-D-RA:J-SAMTEC-TFM-120-X1-XXX-D-RA; MFR: Samtec; MPN: TFM-120-01-L-D-RA
J7 = J-Samtec-FTSH-105-XXX-DV-K-ARM-SWD:FTSH-105-XX-X-DV-K; MFR: Samtec; MPN: FTSH-105-01-F-DV-K
J15 J19 = J-Harwin-M50-3610842R-2X8X1.27_Male :HARWIN-2X8X1.27
JP1 JP2 JP10 JP11 = pinhead:PINHD-2X5: PIN HEADER
JP4 JP6 = J-2X8X1.27:PINHD-1X2: PIN HEADER
JP8 = pinhead:PINHD-1X2: PIN HEADER
JP9 = pinhead:PINHD-1X10: PIN HEADER
L2 = L-ECS-MPI4040:L-ECS-MPI4040; MFR: ECS; MPN: ECS-MPI4040R4-6R8-R
L6-L13 = oresat-rcl:L-US: INDUCTOR, American symbol
Q1 = Q-MOSFET-PCH-SOT23-6:MOSFET-PCH-SOT23-6: P channel MOSFET in an SOT23-6
R1-R7 R9 R10 R12 R16 R17 R27 R36 = oresat-rcl:R-US_: RESISTOR, American symbol; DIS: Digi-Key; DPN: 1276-4275-1-ND; MFR: Samsung; MPN: RC1005F6653CS
R8 R11 R13 R19 R20 R24 R28 R32-R34 R39 R40 = oresat-rcl:R-US_: RESISTOR, American symbol
R14 R15 = R-Panasonic-EXB_A10PXXXJ:EXB-A10P391J; MANUFACTURER_PART_NUMBER: EXBA10P391J; VENDOR: Panasonic
TP1-TP11 TP13-TP20 TP22 TP23 = Tova:TEST-POINT
U1 = U-Maxim-MAX892LEUA+T-power-switch:MAX892LEUA+T: MAX891L / MAX892L Current-Limited, High-Side P-Channel Switch with Thermal Shutdown; MANUFACTURER_PART_NUMBER: MAX892LEUA+T; VENDOR: Maxim Integrated Products
U2 U3 = U-TI-TCAN330-CAN-transceiver:TCAN330; MFR: Texas Instruments; MPN: TCAN330GDCNT
U4 = U-TI-TPS2596XX-eFuse:TPS2596XX: TPS2596XX <http://www.ti.com/product/TPS2596> - eFuse With Accurate Current Monitor and Fast Overvoltage Protection Specifications Input voltage: 2.7-V to 19-V, (21-V Absolute maximum) Overvoltage Protection: Fast overvoltage clamp (3.8-V, 5.7-V and 13.8- V pin-selectable thresholds) with a response time of 5-μs (typical) Current Limiting: Adjustable, 0.125-A to 2-A Current Monitoring: Analog through pin ILIM Operating Temperature Range: –40 °C to +125 °C Body Size: SOIC (8) 4.91 mm x 3.9 mm
U5 = U-TI-TPS6211x-SPS-buck:TPS6211X: TPS6211x 17-V, 1.5-A, Synchronous Step-Down Converter; MFR: TI; MPN: TPS62111RSA
U6 = U-Maxim-MAX6374-watchdog:MAX6374KA-T; MANUFACTURER_PART_NUMBER: max6374kat; VENDOR: Maxim Integrated Products
U7 = U-ST-STM32F446RE-uC:STM32F446RE
U9 = U-C3-eMMC-153pin:EMMC+RESET: eMMC (embedded multi-media card) memory with optional Reset function
U11 U13 = U-ON-Semi-AX5043-radio:U-ONSEMI-AX5043
U12 U14 = U-TI-LP2985XX-N-linear-reg:LP2985XX-N: TI 150mA Low Noise LDO Regulators LP2985-N (various fixed >2.0V) Source: Datasheet <http://www.ti.com/product/LP2985-N?qgpn=lp2985-n> LP2985LV-N (1.5, 1.8, 2.0V fixed) Source: Datasheet <http://www.ti.com/product/LP2985LV-N?qgpn=lp2985lv-n>
U$1 = oresat-cards:ORESAT-CARD-V1.1
U$2 = TrueC3_FTDIlbr:C3_FTDI_CONN
X1 = low-gain-radio:CRYSTAL-WITH-GND; DIS: Digi-Key; DPN: XC2181CT-ND; MFR: ECS Inc.; MPN: ECS-160-10-36Q-ES-TR
X3 X4 = X-Taitien-TY-TCXO:TAITIEN-TY: Clipped Sine Wave TCXO Stability: 1.0ppm (-40 to +85 ℃) Source: Datasheet <https://www.taitien.com/wp-content/uploads/2015/12/XO-0081_TY.pdf>

## Net classes
1 RF1: clearance 0.8 mm
2 RF2: clearance 0.4 mm